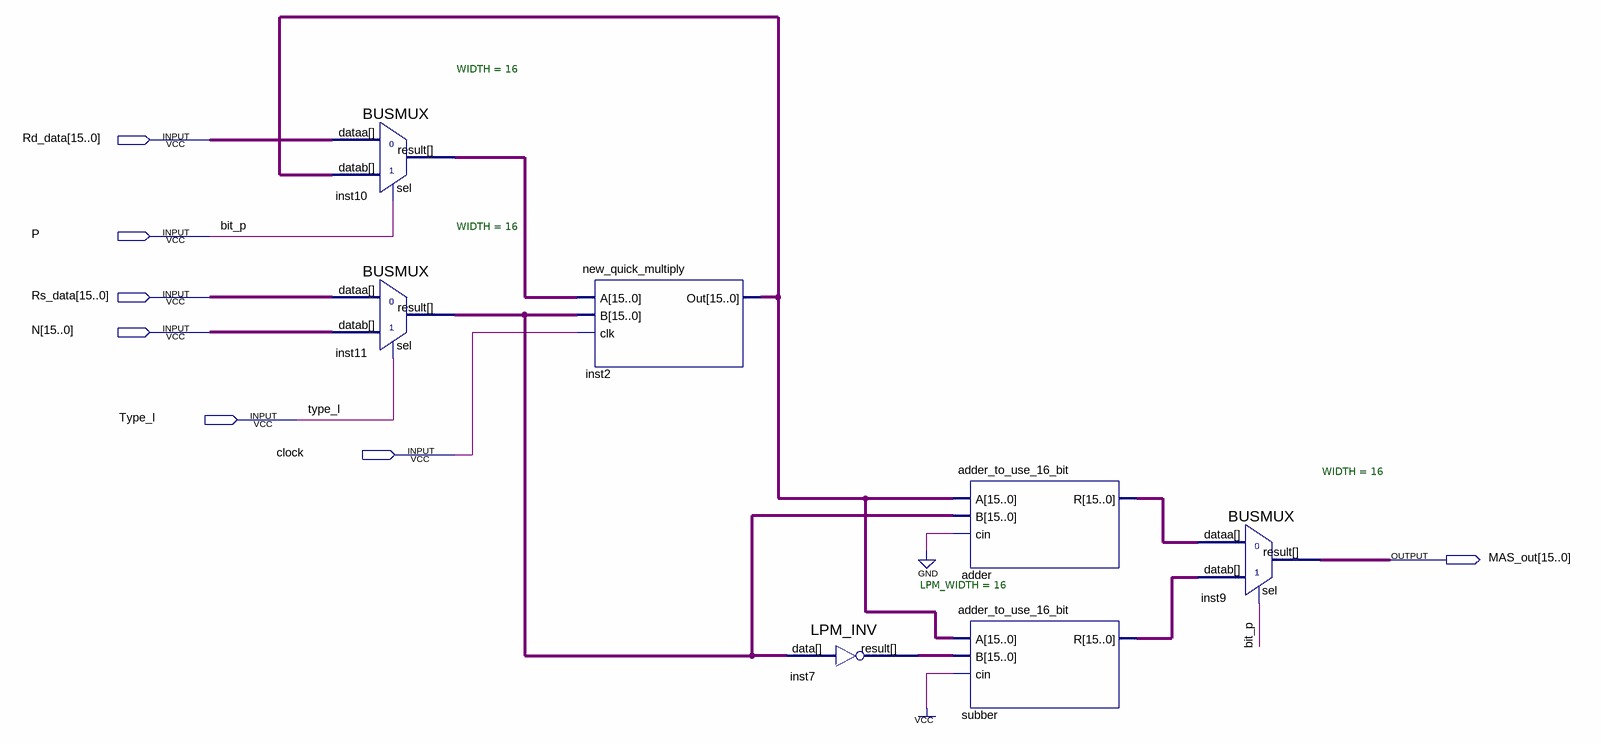
[diagram p0: schematic sheet]
// Quartus schematic new_MAS.bdf as structural Verilog: 7 symbols, 7 pins
module new_MAS (
  input  [15:0] Rd_data,
  input  P,
  input  [15:0] Rs_data,
  input  [15:0] N,
  input  Type_I,
  input  clock,
  output [15:0] MAS_out
);

  wire [15:0] adder_r, inst2_out, inst7_result, inst10_result, inst11_result, subber_r;

  BUSMUX #(.WIDTH(16)) inst10 (.datab(inst2_out), .sel(P), .dataa(Rd_data), .result(inst10_result));
  BUSMUX #(.WIDTH(16)) inst11 (.datab(N), .sel(Type_I), .dataa(Rs_data), .result(inst11_result));
  new_quick_multiply inst2 (.A(inst10_result), .B(inst11_result), .clk(clock), .Out(inst2_out));
  LPM_INV #(.LPM_WIDTH(16)) inst7 (.data(inst11_result), .result(inst7_result));
  adder_to_use_16_bit adder (.A(inst2_out), .B(inst11_result), .cin(1'b0), .R(adder_r));
  adder_to_use_16_bit subber (.A(inst2_out), .B(inst7_result), .cin(1'b1), .R(subber_r));
  BUSMUX #(.WIDTH(16)) inst9 (.datab(subber_r), .sel(P), .dataa(adder_r), .result(MAS_out));

  // Other names for the same wires on the sheet: bit_p = P
endmodule
